# EAGLE design eye (EAGLE 9.6.2)

## Sheet 1 of 2
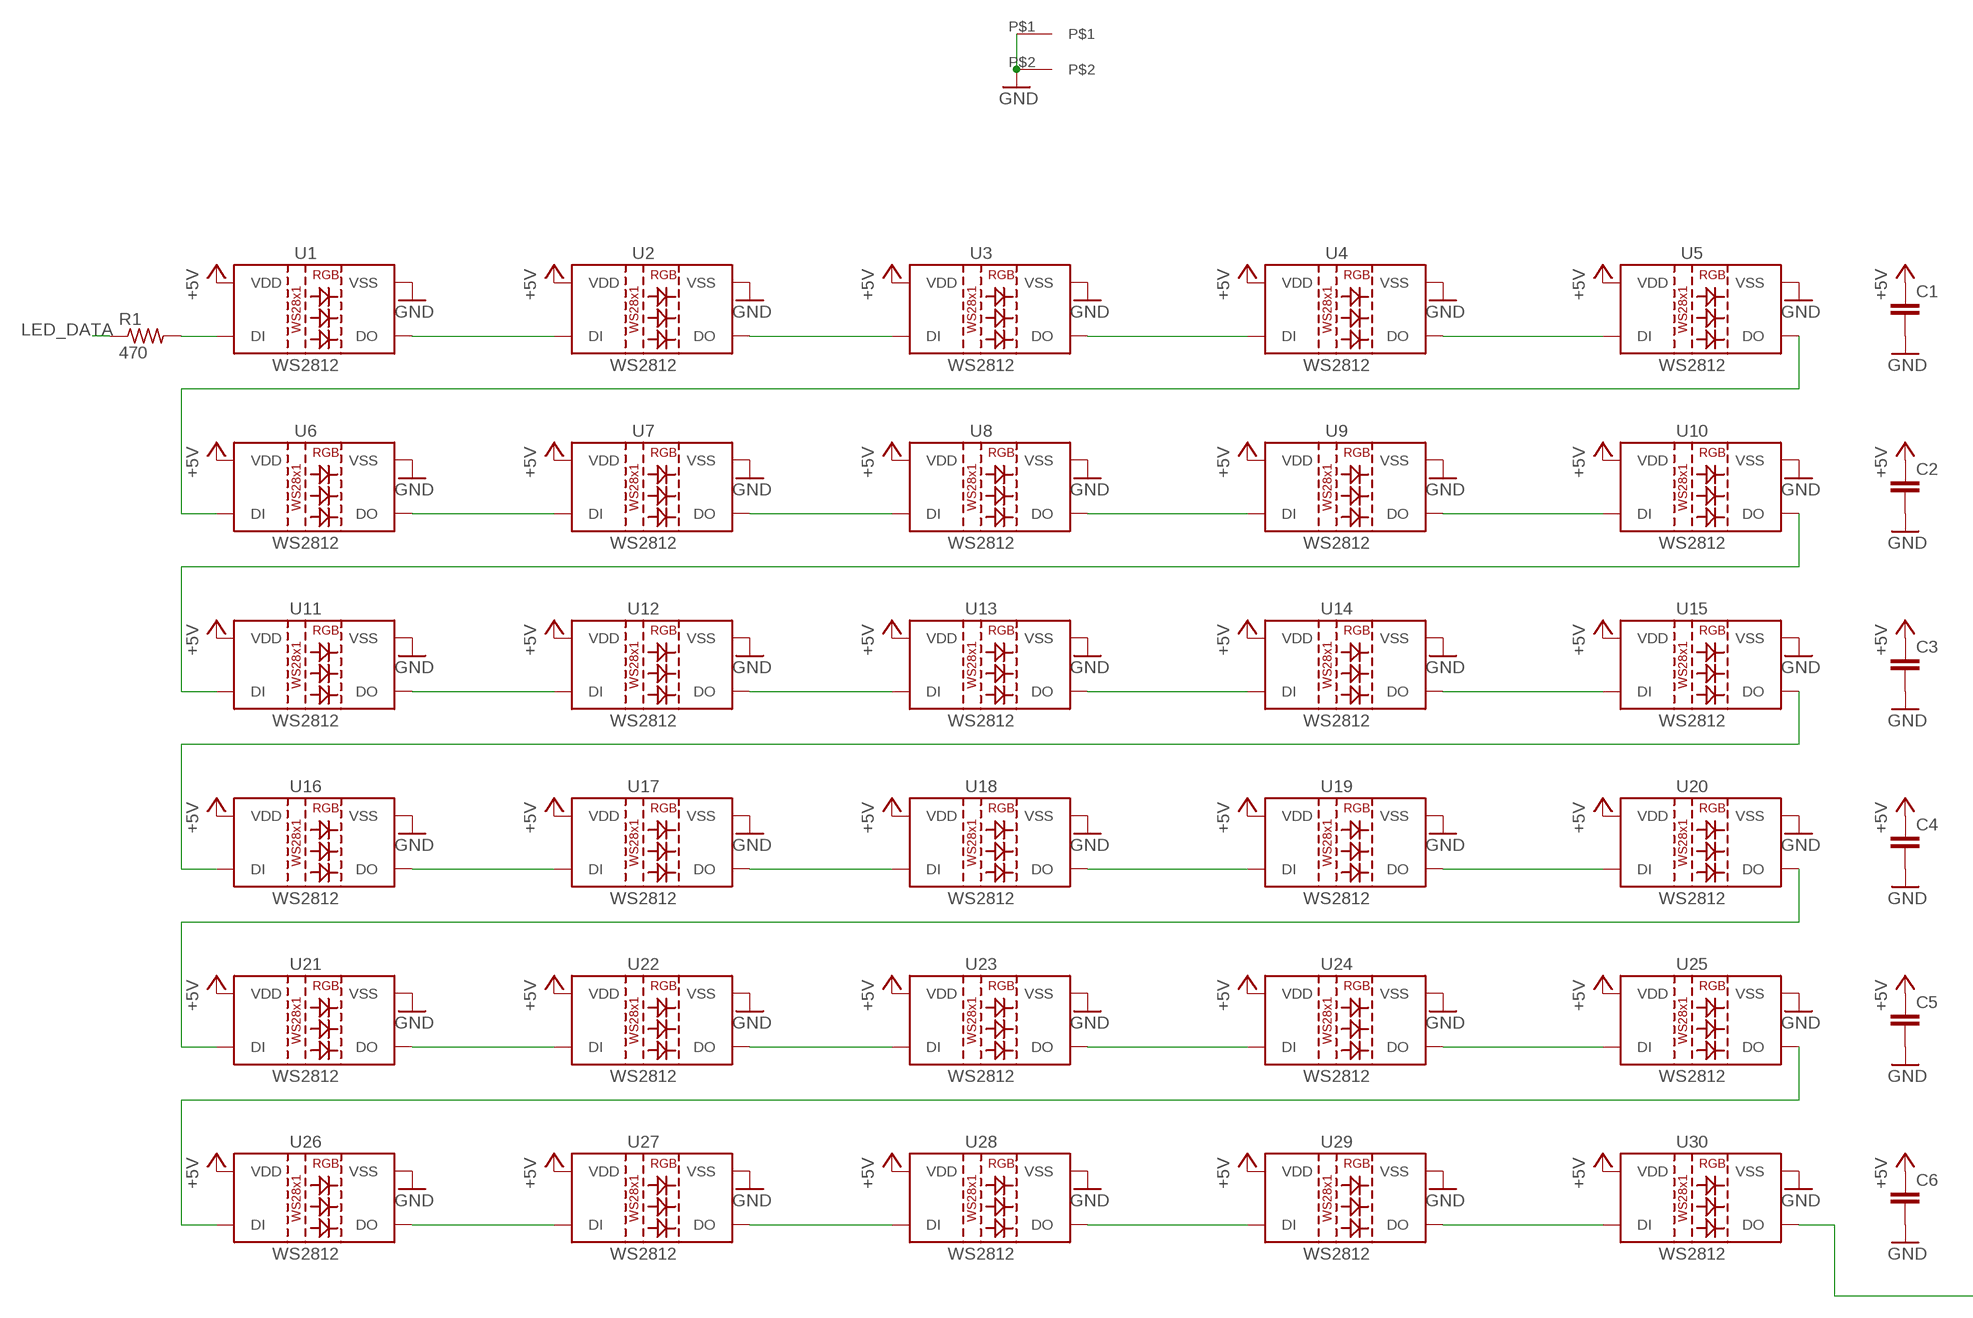
[diagram p0: schematic, sheet 1, part 1 of 2]
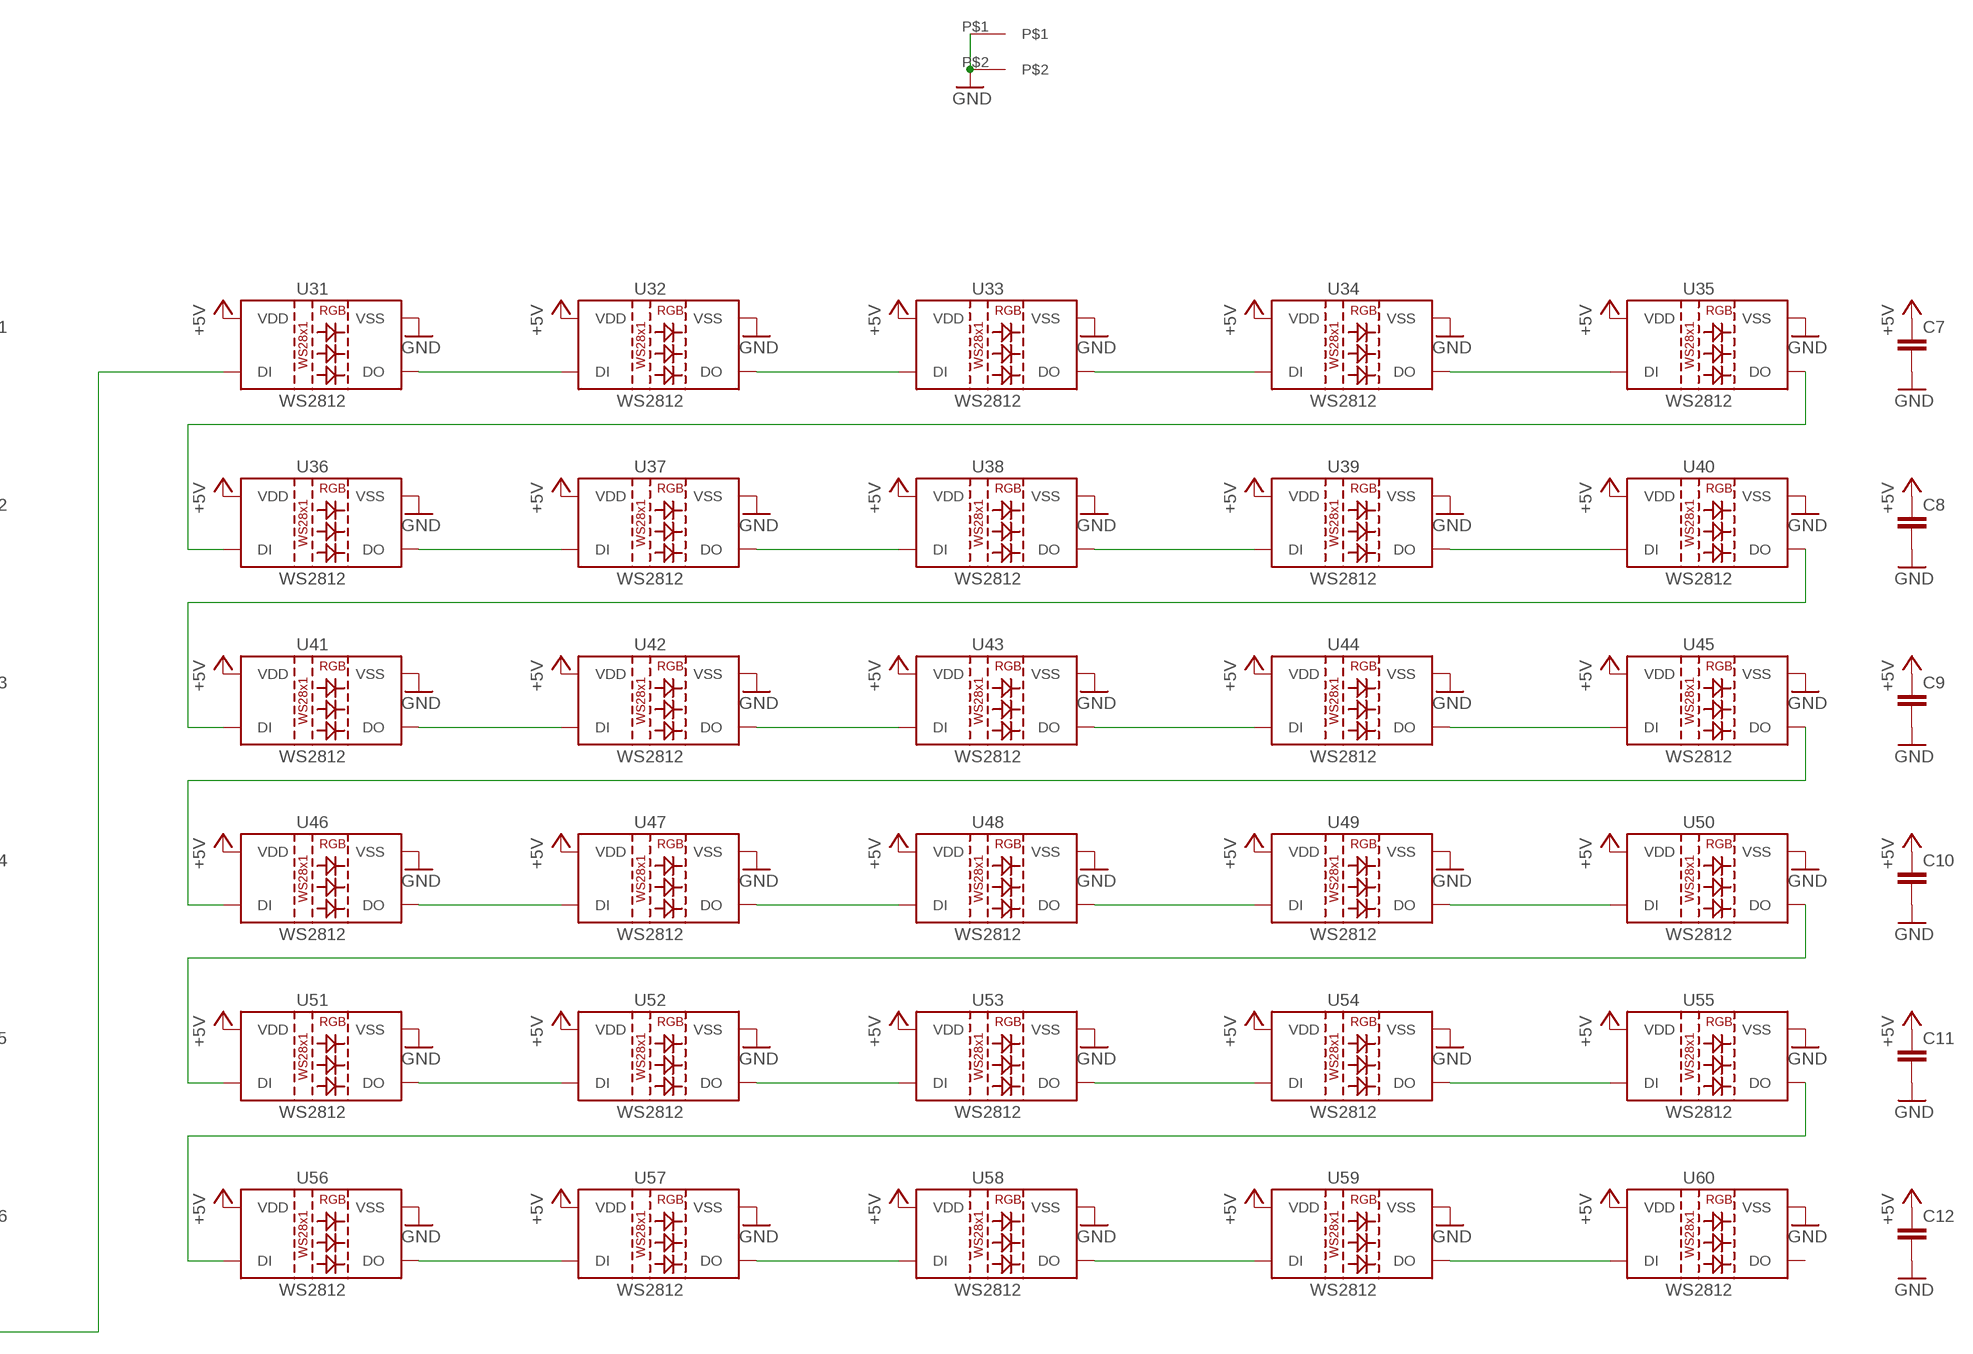
[diagram p1: schematic, sheet 1, part 2 of 2]

### Parts
C1  C-EUC0603  [C0603]
C2  C-EUC0603  [C0603]
C3  C-EUC0603  [C0603]
C4  C-EUC0603  [C0603]
C5  C-EUC0603  [C0603]
C6  C-EUC0603  [C0603]
C7  C-EUC0603  [C0603]
C8  C-EUC0603  [C0603]
C9  C-EUC0603  [C0603]
C10  C-EUC0603  [C0603]
C11  C-EUC0603  [C0603]
C12  C-EUC0603  [C0603]
R1  470  R-US_R0603  [R0603]
U1  WS2812  WS2812"  [LED-TRICOLOR-5050-IC]
U2  WS2812  WS2812"  [LED-TRICOLOR-5050-IC]
U3  WS2812  WS2812"  [LED-TRICOLOR-5050-IC]
U4  WS2812  WS2812"  [LED-TRICOLOR-5050-IC]
U5  WS2812  WS2812"  [LED-TRICOLOR-5050-IC]
U6  WS2812  WS2812"  [LED-TRICOLOR-5050-IC]
U7  WS2812  WS2812"  [LED-TRICOLOR-5050-IC]
U8  WS2812  WS2812"  [LED-TRICOLOR-5050-IC]
U9  WS2812  WS2812"  [LED-TRICOLOR-5050-IC]
U10  WS2812  WS2812"  [LED-TRICOLOR-5050-IC]
U11  WS2812  WS2812"  [LED-TRICOLOR-5050-IC]
U12  WS2812  WS2812"  [LED-TRICOLOR-5050-IC]
U13  WS2812  WS2812"  [LED-TRICOLOR-5050-IC]
U14  WS2812  WS2812"  [LED-TRICOLOR-5050-IC]
U15  WS2812  WS2812"  [LED-TRICOLOR-5050-IC]
U16  WS2812  WS2812"  [LED-TRICOLOR-5050-IC]
U17  WS2812  WS2812"  [LED-TRICOLOR-5050-IC]
U18  WS2812  WS2812"  [LED-TRICOLOR-5050-IC]
U19  WS2812  WS2812"  [LED-TRICOLOR-5050-IC]
U20  WS2812  WS2812"  [LED-TRICOLOR-5050-IC]
U21  WS2812  WS2812"  [LED-TRICOLOR-5050-IC]
U22  WS2812  WS2812"  [LED-TRICOLOR-5050-IC]
U23  WS2812  WS2812"  [LED-TRICOLOR-5050-IC]
U24  WS2812  WS2812"  [LED-TRICOLOR-5050-IC]
U25  WS2812  WS2812"  [LED-TRICOLOR-5050-IC]
U26  WS2812  WS2812"  [LED-TRICOLOR-5050-IC]
U27  WS2812  WS2812"  [LED-TRICOLOR-5050-IC]
U28  WS2812  WS2812"  [LED-TRICOLOR-5050-IC]
U29  WS2812  WS2812"  [LED-TRICOLOR-5050-IC]
U30  WS2812  WS2812"  [LED-TRICOLOR-5050-IC]
U31  WS2812  WS2812"  [LED-TRICOLOR-5050-IC]
U32  WS2812  WS2812"  [LED-TRICOLOR-5050-IC]
U33  WS2812  WS2812"  [LED-TRICOLOR-5050-IC]
U34  WS2812  WS2812"  [LED-TRICOLOR-5050-IC]
U35  WS2812  WS2812"  [LED-TRICOLOR-5050-IC]
U36  WS2812  WS2812"  [LED-TRICOLOR-5050-IC]
U37  WS2812  WS2812"  [LED-TRICOLOR-5050-IC]
U38  WS2812  WS2812"  [LED-TRICOLOR-5050-IC]
U39  WS2812  WS2812"  [LED-TRICOLOR-5050-IC]
U40  WS2812  WS2812"  [LED-TRICOLOR-5050-IC]
U41  WS2812  WS2812"  [LED-TRICOLOR-5050-IC]
U42  WS2812  WS2812"  [LED-TRICOLOR-5050-IC]
U43  WS2812  WS2812"  [LED-TRICOLOR-5050-IC]
U44  WS2812  WS2812"  [LED-TRICOLOR-5050-IC]
U45  WS2812  WS2812"  [LED-TRICOLOR-5050-IC]
U46  WS2812  WS2812"  [LED-TRICOLOR-5050-IC]
U47  WS2812  WS2812"  [LED-TRICOLOR-5050-IC]
U48  WS2812  WS2812"  [LED-TRICOLOR-5050-IC]
U49  WS2812  WS2812"  [LED-TRICOLOR-5050-IC]
U50  WS2812  WS2812"  [LED-TRICOLOR-5050-IC]
U51  WS2812  WS2812"  [LED-TRICOLOR-5050-IC]
U52  WS2812  WS2812"  [LED-TRICOLOR-5050-IC]
U53  WS2812  WS2812"  [LED-TRICOLOR-5050-IC]
U54  WS2812  WS2812"  [LED-TRICOLOR-5050-IC]
U55  WS2812  WS2812"  [LED-TRICOLOR-5050-IC]
U56  WS2812  WS2812"  [LED-TRICOLOR-5050-IC]
U57  WS2812  WS2812"  [LED-TRICOLOR-5050-IC]
U58  WS2812  WS2812"  [LED-TRICOLOR-5050-IC]
U59  WS2812  WS2812"  [LED-TRICOLOR-5050-IC]
U60  WS2812  WS2812"  [LED-TRICOLOR-5050-IC]
U$4  GLASSES_HINGE  [GLASSES_HINGE]
U$5  GLASSES_HINGE  [GLASSES_HINGE]

### Nets
+5V: C1.1 C2.1 C3.1 C4.1 C5.1 C6.1 C7.1 C8.1 C9.1 C10.1 C11.1 C12.1 U1.3(VDD) U1.5(VDD) U2.3(VDD) U2.5(VDD) U3.3(VDD) U3.5(VDD) U4.3(VDD) U4.5(VDD) U5.3(VDD) U5.5(VDD) U6.3(VDD) U6.5(VDD) U7.3(VDD) U7.5(VDD) U8.3(VDD) U8.5(VDD) U9.3(VDD) U9.5(VDD) U10.3(VDD) U10.5(VDD) U11.3(VDD) U11.5(VDD) U12.3(VDD) U12.5(VDD) U13.3(VDD) U13.5(VDD) U14.3(VDD) U14.5(VDD) U15.3(VDD) U15.5(VDD) U16.3(VDD) U16.5(VDD) U17.3(VDD) U17.5(VDD) U18.3(VDD) U18.5(VDD) U19.3(VDD) U19.5(VDD) U20.3(VDD) U20.5(VDD) U21.3(VDD) U21.5(VDD) U22.3(VDD) U22.5(VDD) U23.3(VDD) U23.5(VDD) U24.3(VDD) U24.5(VDD) U25.3(VDD) U25.5(VDD) U26.3(VDD) U26.5(VDD) U27.3(VDD) U27.5(VDD) U28.3(VDD) U28.5(VDD) U29.3(VDD) U29.5(VDD) U30.3(VDD) U30.5(VDD) U31.3(VDD) U31.5(VDD) U32.3(VDD) U32.5(VDD) U33.3(VDD) U33.5(VDD) U34.3(VDD) U34.5(VDD) U35.3(VDD) U35.5(VDD) U36.3(VDD) U36.5(VDD) U37.3(VDD) U37.5(VDD) U38.3(VDD) U38.5(VDD) U39.3(VDD) U39.5(VDD) U40.3(VDD) U40.5(VDD) U41.3(VDD) U41.5(VDD) U42.3(VDD) U42.5(VDD) U43.3(VDD) U43.5(VDD) U44.3(VDD) U44.5(VDD) U45.3(VDD) U45.5(VDD) U46.3(VDD) U46.5(VDD) U47.3(VDD) U47.5(VDD) U48.3(VDD) U48.5(VDD) U49.3(VDD) U49.5(VDD) U50.3(VDD) U50.5(VDD) U51.3(VDD) U51.5(VDD) U52.3(VDD) U52.5(VDD) U53.3(VDD) U53.5(VDD) U54.3(VDD) U54.5(VDD) U55.3(VDD) U55.5(VDD) U56.3(VDD) U56.5(VDD) U57.3(VDD) U57.5(VDD) U58.3(VDD) U58.5(VDD) U59.3(VDD) U59.5(VDD) U60.3(VDD) U60.5(VDD) ; also sheet 2
GND: C1.2 C2.2 C3.2 C4.2 C5.2 C6.2 C7.2 C8.2 C9.2 C10.2 C11.2 C12.2 U1.6(VSS) U2.6(VSS) U3.6(VSS) U4.6(VSS) U5.6(VSS) U6.6(VSS) U7.6(VSS) U8.6(VSS) U9.6(VSS) U10.6(VSS) U11.6(VSS) U12.6(VSS) U13.6(VSS) U14.6(VSS) U15.6(VSS) U16.6(VSS) U17.6(VSS) U18.6(VSS) U19.6(VSS) U20.6(VSS) U21.6(VSS) U22.6(VSS) U23.6(VSS) U24.6(VSS) U25.6(VSS) U26.6(VSS) U27.6(VSS) U28.6(VSS) U29.6(VSS) U30.6(VSS) U31.6(VSS) U32.6(VSS) U33.6(VSS) U34.6(VSS) U35.6(VSS) U36.6(VSS) U37.6(VSS) U38.6(VSS) U39.6(VSS) U40.6(VSS) U41.6(VSS) U42.6(VSS) U43.6(VSS) U44.6(VSS) U45.6(VSS) U46.6(VSS) U47.6(VSS) U48.6(VSS) U49.6(VSS) U50.6(VSS) U51.6(VSS) U52.6(VSS) U53.6(VSS) U54.6(VSS) U55.6(VSS) U56.6(VSS) U57.6(VSS) U58.6(VSS) U59.6(VSS) U60.6(VSS) U$4.P$1 U$4.P$2 U$5.P$1 U$5.P$2 ; also sheet 2
LED_DATA: R1.1 ; also sheet 2
N$1: U1.1(DO) U2.2(DI)
N$2: U2.1(DO) U3.2(DI)
N$3: U3.1(DO) U4.2(DI)
N$4: U4.1(DO) U5.2(DI)
N$5: U5.1(DO) U6.2(DI)
N$6: U6.1(DO) U7.2(DI)
N$7: U7.1(DO) U8.2(DI)
N$8: U8.1(DO) U9.2(DI)
N$9: U9.1(DO) U10.2(DI)
N$10: U10.1(DO) U11.2(DI)
N$11: U11.1(DO) U12.2(DI)
N$12: U12.1(DO) U13.2(DI)
N$13: U13.1(DO) U14.2(DI)
N$14: U14.1(DO) U15.2(DI)
N$15: U15.1(DO) U16.2(DI)
N$16: U16.1(DO) U17.2(DI)
N$17: U17.1(DO) U18.2(DI)
N$18: U18.1(DO) U19.2(DI)
N$19: U19.1(DO) U20.2(DI)
N$20: U20.1(DO) U21.2(DI)
N$21: U21.1(DO) U22.2(DI)
N$22: U22.1(DO) U23.2(DI)
N$23: U23.1(DO) U24.2(DI)
N$24: U24.1(DO) U25.2(DI)
N$25: U25.1(DO) U26.2(DI)
N$26: U26.1(DO) U27.2(DI)
N$27: U27.1(DO) U28.2(DI)
N$28: U28.1(DO) U29.2(DI)
N$29: U29.1(DO) U30.2(DI)
N$31: U31.1(DO) U32.2(DI)
N$32: U32.1(DO) U33.2(DI)
N$33: U33.1(DO) U34.2(DI)
N$34: U34.1(DO) U35.2(DI)
N$35: U35.1(DO) U36.2(DI)
N$36: U36.1(DO) U37.2(DI)
N$37: U37.1(DO) U38.2(DI)
N$38: U38.1(DO) U39.2(DI)
N$39: U39.1(DO) U40.2(DI)
N$40: U40.1(DO) U41.2(DI)
N$41: U41.1(DO) U42.2(DI)
N$42: U42.1(DO) U43.2(DI)
N$43: U43.1(DO) U44.2(DI)
N$44: U44.1(DO) U45.2(DI)
N$45: U45.1(DO) U46.2(DI)
N$46: U46.1(DO) U47.2(DI)
N$47: U47.1(DO) U48.2(DI)
N$48: U48.1(DO) U49.2(DI)
N$49: U49.1(DO) U50.2(DI)
N$50: U50.1(DO) U51.2(DI)
N$51: U51.1(DO) U52.2(DI)
N$52: U52.1(DO) U53.2(DI)
N$53: U53.1(DO) U54.2(DI)
N$54: U54.1(DO) U55.2(DI)
N$55: U55.1(DO) U56.2(DI)
N$56: U56.1(DO) U57.2(DI)
N$57: U57.1(DO) U58.2(DI)
N$58: U58.1(DO) U59.2(DI)
N$59: U59.1(DO) U60.2(DI)
N$60: U30.1(DO) U31.2(DI)
N$61: R1.2 U1.2(DI)
Unconnected: U60.1(DO)

## Sheet 2 of 2
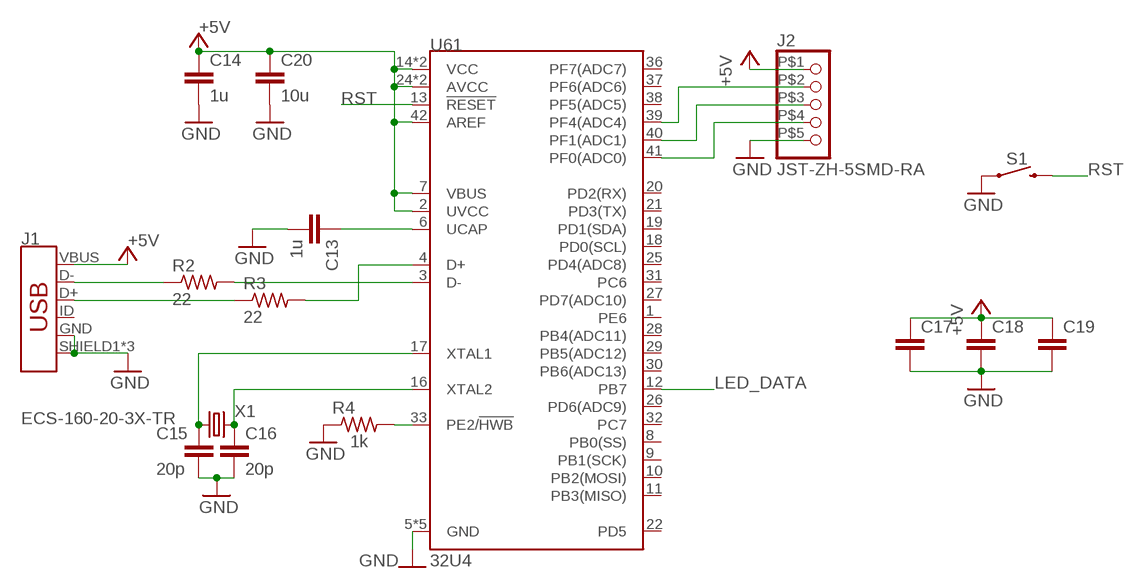
[diagram p2: schematic, sheet 2]

### Parts
C13  1u  C-EUC0603  [C0603]
C14  1u  C-EUC0603  [C0603]
C15  20p  C-EUC0603  [C0603]
C16  20p  C-EUC0603  [C0603]
C17  C-EUC0603  [C0603]
C18  C-EUC0603  [C0603]
C19  C-EUC0603  [C0603]
C20  10u  C-EUC0603  [C0603]
J1  USB_MICRO-B_FEMALE-SMT  [USB-B-MICRO-SMD]
J2  JST-ZH-5SMD-RA  [JST-ZH-5-SMD-RA]
R2  22  R-US_R0603  [R0603]
R3  22  R-US_R0603  [R0603]
R4  1k  R-US_R0603  [R0603]
S1  MOMENTARY-SWITCH-SPST-SMD-6.0X3.5MM  [TACTILE_SWITCH_SMD_6.0X3.5MM]
U61  32U4  ATMEGA32U4QFN  [QFN-44]
X1  ECS-160-20-3X-TR  CRYSTALSMD-5X3.2-2PAD  [CRYSTAL-SMD-5X3.2-2PAD]

### Nets
+5V: C14.1 C17.1 C18.1 C19.1 C20.1 J1.VBUS J2.P$1 U61.2(UVCC) U61.7(VBUS) U61.14(VCC) U61.24(AVCC) U61.34(VCC) U61.42(AREF) U61.44(AVCC) ; also sheet 1
GND: C13.2 C14.2 C15.2 C16.2 C17.2 C18.2 C19.2 C20.2 J1.GND J1.SHIELD1(SHIELD) J1.SHIELD2(SHIELD) J1.SHIELD3(SHIELD) J2.P$5 R4.1 S1.1 U61.5(GND) U61.15(GND) U61.23(GND) U61.35(GND) U61.43(GND) ; also sheet 1
LED_DATA: U61.12(PB7) ; also sheet 1
N$30: J2.P$4 U61.41(PF0(ADC0))
N$62: C13.1 U61.6(UCAP)
N$63: J2.P$3 U61.40(PF1(ADC1))
N$64: J2.P$2 U61.39(PF4(ADC4))
N$67: C16.1 U61.16(XTAL2) X1.P$2
N$68: C15.1 U61.17(XTAL1) X1.P$1
N$77: R4.2 U61.33(PE2/!HWB)
RST: S1.2 U61.13(!RESET)
USB1_N [diff_pair]: J1.D- R2.1
USB1_P [diff_pair]: J1.D+ R3.1
USB_N [diff_pair]: R2.2 U61.3(D-)
USB_P [diff_pair]: R3.2 U61.4(D+)
Unconnected: J1.ID U61.1(PE6) U61.8(PB0(SS)) U61.9(PB1(SCK)) U61.10(PB2(MOSI)) U61.11(PB3(MISO)) U61.18(PD0(SCL)) U61.19(PD1(SDA)) U61.20(PD2(RX)) U61.21(PD3(TX)) U61.22(PD5) U61.25(PD4(ADC8)) U61.26(PD6(ADC9)) U61.27(PD7(ADC10)) U61.28(PB4(ADC11)) U61.29(PB5(ADC12)) U61.30(PB6(ADC13)) U61.31(PC6) U61.32(PC7) U61.36(PF7(ADC7)) U61.37(PF6(ADC6)) U61.38(PF5(ADC5))

## Library data of the parts
C1-C20 = rcl:C-EU: CAPACITOR, European symbol; SPICEPREFIX: C
J1 = SparkFun-Connectors:USB_MICRO-B: USB Type Micro-B Connector Male/female and PTH/SMT variants SparkFun Products: SparkFun microB USB Breakout <https://www.sparkfun.com/products/12035> SparkFun USB microB Plug Breakout <https://www.sparkfun.com/products/10031> SparkFun ESP8266 Thing <https://www.sparkfun.com/products/13231>; PROD_ID: CONN-11752
J2 = josh:JST-ZH-5
R1-R4 = rcl:R-US_: RESISTOR, American symbol; SPICEPREFIX: R
S1 = SparkFun-Switches:MOMENTARY-SWITCH-SPST: Momentary Switch (Pushbutton) - SPST Normally-open (NO) SPST momentary switches (buttons, pushbuttons). Variants PTH-12MM - 12mm square, through-hole Momentary Pushbutton Switch - 12mm Square <https://www.sparkfun.com/products/9190> (COM-09190) PTH-6.0MM, PTH-6.0MM-KIT - 6.0mm square, through-hole Mini Pushbutton Switch <https://www.sparkfun.com/products/97> (COM-00097) KIT package intended for soldering kit's - only one side of pads' copper is exposed. PTH-RIGHT-ANGLE-KIT - Right-angle, through-hole Right Angle Tactile Button <https://www.sparkfun.com/products/10791> - Used on SparkFun BigTime Watch Kit <https://www.sparkfun.com/products/11734> SMD-12MM - 12mm square, surface-mount Tactile Button - SMD (12mm) <https://www.sparkfun.com/products/12993> (COM-12993) Used on SparkFun PicoBoard <https://www.sparkfun.com/products/11888> SMD-4.5MM - 4.5mm Square Trackball Switch Used on SparkFun Blackberry Trackballer Breakout <https://www.sparkfun.com/products/13169> SMD-4.6MMX2.8MM - 4.60mm x 2.80mm, surface mount Used on SparkFun SAMD21 Mini Breakout <https://www.sparkfun.com/products/13664> SMD-5.2MM, SMD-5.2-REDUNDANT - 5.2mm square, surface-mount Mini Pushbutton Switch - SMD <https://www.sparkfun.com/products/8720> (COM-08720) Used on Arduino Pro Mini <https://www.sparkfun.com/products/11114> REDUNDANT package connects both switch circuits together SMD-6.0X3.5MM - 6.0 x 3.5mm, surface mount Momentary Reset Switch SMD <https://www.sparkfun.com/products/8229> (COM-08229) SMD-6.2MM-TALL - 6.2mm square, surface mount Tactile Button - SMD (6mm) <https://www.sparkfun.com/products/12992> Used on SparkFun Digital Sandbox <https://www.sparkfun.com/products/12651> SMD-RIGHT-ANGLE - Right-angle, surface mount Used on SparkFun Block for Intel® Edison - Arduino <https://www.sparkfun.com/products/13036>; PROD_ID: SWCH-14278; SF_SKU: COM-08229
U1-U60 = SparkFun-LED:WS2812: WS2812 RGB LED w/ WS2811 driver 5x5mm SMD LED with built-in controller IC. Color: Red/Green/Blue mC Rating: RGB: 550, 1100, 200 mcd Current:RGB: 20, 20, 20 mA Forward Voltage: RGB: 1.8, 3.0, 3.2 V Packages:LED-TRICOLOR-5050-IC SparkFun Products: LED-SMD RGB (WS2812) <https://www.sparkfun.com/products/11821>; PROD_ID: DIO-11598
U61 = SparkFun-IC-Microcontroller:ATMEGA32U4: Atmel MCU, 32KByte Atmel 44-pin 8-bit Microcontroller with 32KBytes of ISP Flash and USB Controller Datasheet <http://cdn.sparkfun.com/datasheets/Dev/Arduino/Boards/ATMega32U4.pdf> SparkFun Products LilyPad Arduino USB - ATmega32U4 Board <https://www.sparkfun.com/products/12049> (DEV-12049) Pro Micro - 5V/16MHz <https://www.sparkfun.com/products/12640> (DEV-12640) Pro Micro - 3.3V/8MHz <https://www.sparkfun.com/products/12587> (DEV-12587) Fio v3 - ATmega32U4 <https://www.sparkfun.com/products/11520> (DEV-11520) Qduino Mini <https://www.sparkfun.com/products/13614> (DEV-13614) Makey Makey - Standard Kit <https://www.sparkfun.com/products/11511> (WIG-11511) Makey Makey Deluxe Kit <https://www.sparkfun.com/products/11519> (WIG-11519); PROD_ID: IC-10828
U$4 U$5 = josh:GLASSES_HINGE
X1 = SparkFun-Clocks:CRYSTAL: Crystals (Generic) These are passive quartz crystals, which can be used as a clock source for a microcontroller. Crystal's are two-terminal devices. They require external "load" capacitors to generate an oscillating signal.

## Net classes
2 mult: clearance 0.025 mm

## Board
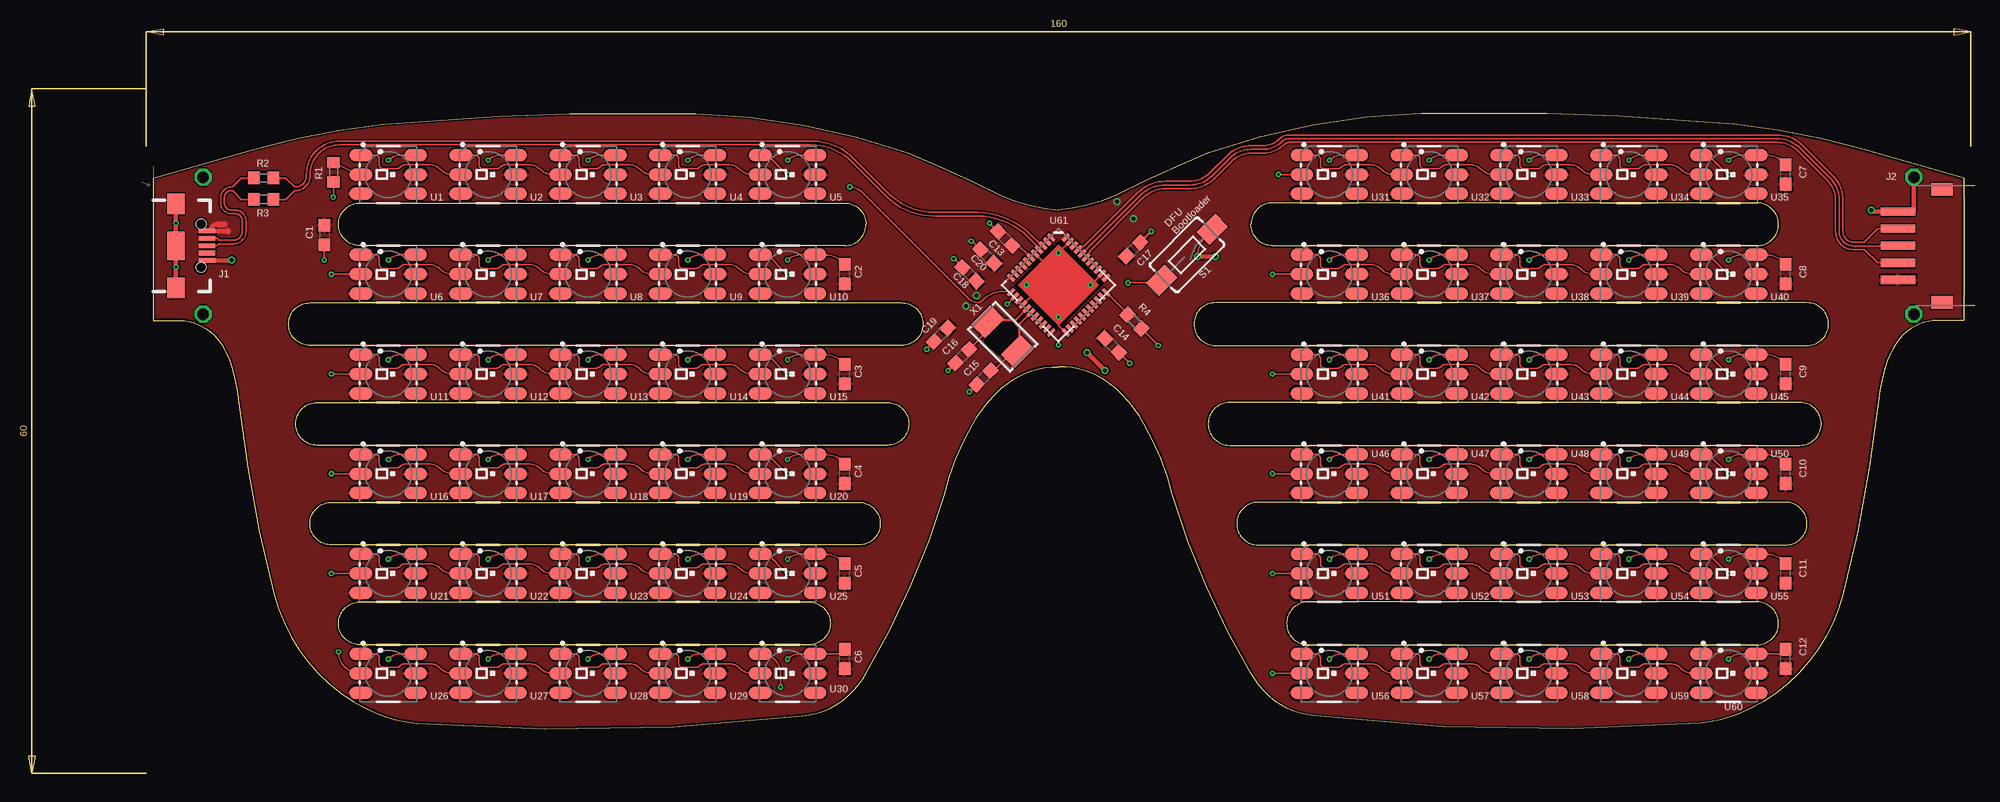
[diagram p3: board, top side]
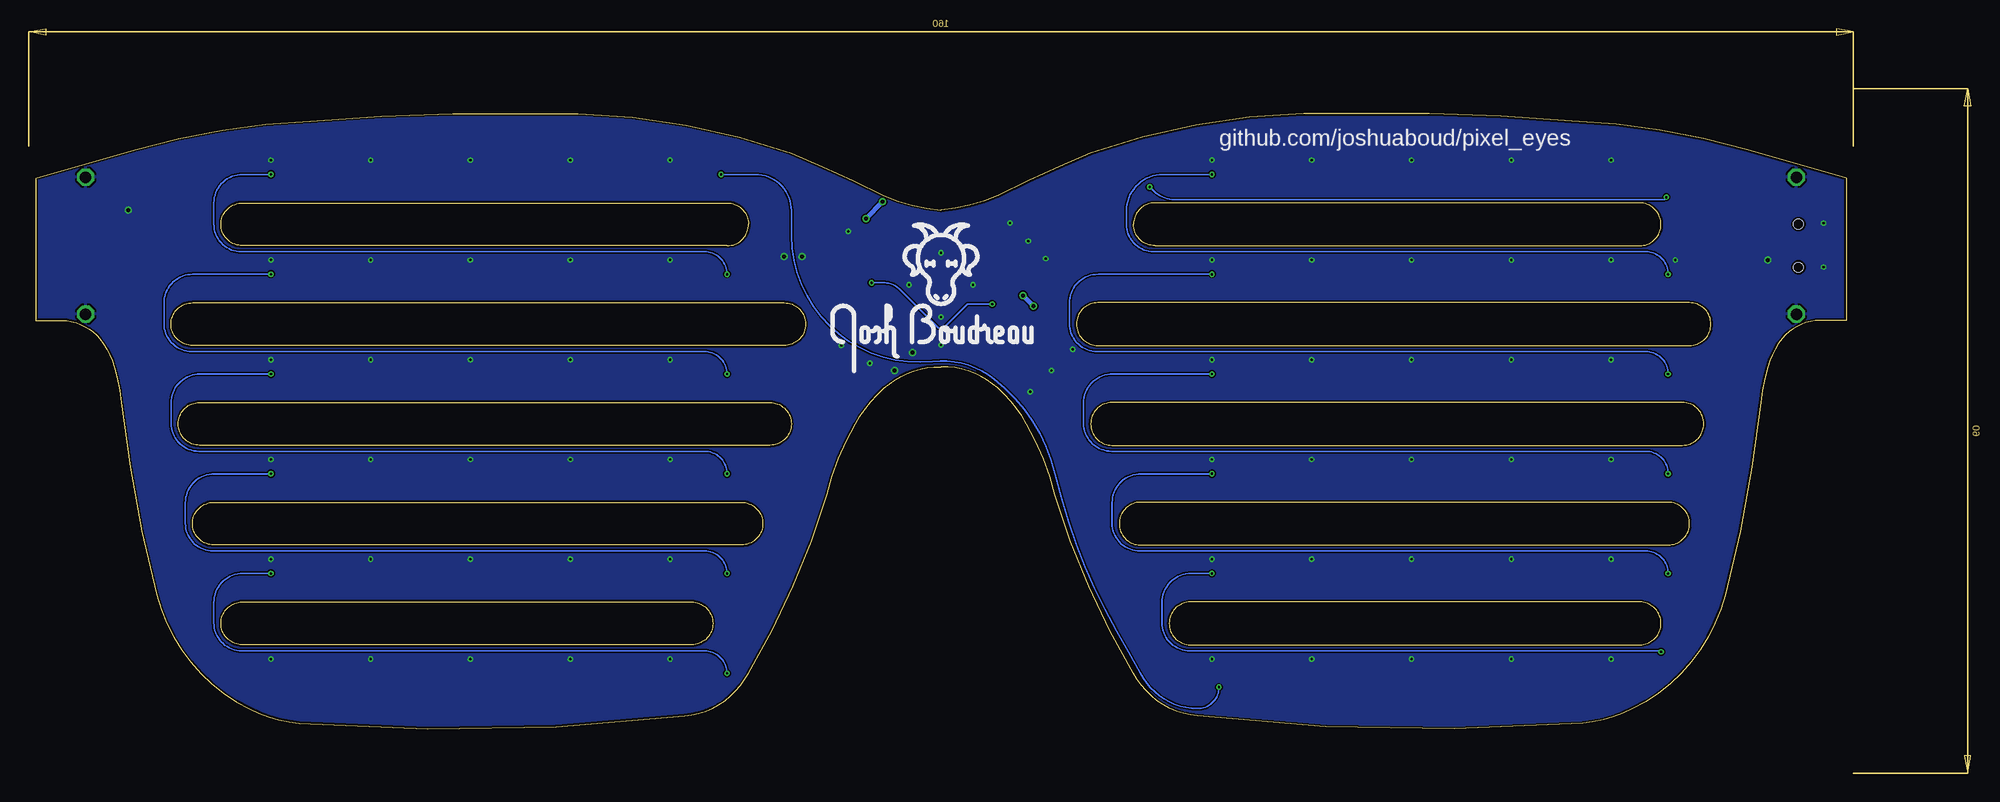
[diagram p4: board, bottom side, seen from below]

Size 158.75 x 53.97 mm. Coordinates in mm from the lower left corner, seen from the top.
Outline: 0,48.32 8.75,50.82 arc-13 24.06,53.32 arc-6 42.81,53.94 arc-22 66.25,50.51 arc-4 74.38,46.76 arc17 79.38,45.51 arc17 84.38,46.76 arc-4 92.5,50.51 arc-22 115.94,53.94 arc-6 134.69,53.32 arc-13 150,50.82 158.75,48.32 158.75,35.82 156.88,35.82 arc53 153.12,34.26 arc21 151.88,31.76 arc10 151.25,28.63 arc-8 148.12,11.76 arc-49 140,1.76 arc-21 135.62,0.51 arc-11 101.88,1.13 arc-56 96.25,4.88 arc-14 89.38,20.51 arc16 86.88,26.76 arc18 84.38,29.88 arc43 79.38,31.76 arc43 74.38,29.88 arc18 71.88,26.76 arc16 69.38,20.51 arc-14 62.5,4.88 arc-56 56.88,1.13 arc-11 23.12,0.51 arc-21 18.75,1.76 arc-49 10.62,11.76 arc-8 7.5,28.63 arc10 6.88,31.76 arc21 5.62,34.26 arc53 1.88,35.82 0,35.82 0,48.32
Outline: 18.12,46.13 60.62,46.13 arc-90 62.5,44.26 arc-90 60.62,42.38 18.12,42.38 arc-90 16.25,44.26 arc-90 18.12,46.13
Outline: 11.88,35.51 arc-90 13.75,37.38 65.62,37.38 arc-90 67.5,35.51 arc-90 65.62,33.63 13.75,33.63 arc-90 11.88,35.51
Outline: 12.5,26.76 arc-90 14.38,28.63 64.38,28.63 arc-90 66.25,26.76 arc-90 64.38,24.88 14.38,24.88 arc-90 12.5,26.76
Outline: 13.75,18.01 arc-90 15.62,19.88 61.88,19.88 arc-90 63.75,18.01 arc-90 61.88,16.13 15.62,16.13 arc-90 13.75,18.01
Outline: 16.25,9.26 arc-90 18.12,11.13 57.5,11.13 arc-90 59.38,9.26 arc-90 57.5,7.38 18.12,7.38 arc-90 16.25,9.26
Outline: 140.62,46.13 98.12,46.13 arc90 96.25,44.26 arc90 98.12,42.38 140.62,42.38 arc90 142.5,44.26 arc90 140.62,46.13
Outline: 146.88,35.51 arc90 145,37.38 93.12,37.38 arc90 91.25,35.51 arc90 93.12,33.63 145,33.63 arc90 146.88,35.51
Outline: 146.25,26.76 arc90 144.38,28.63 94.38,28.63 arc90 92.5,26.76 arc90 94.38,24.88 144.38,24.88 arc90 146.25,26.76
Outline: 145,18.01 arc90 143.12,19.88 96.88,19.88 arc90 95,18.01 arc90 96.88,16.13 143.12,16.13 arc90 145,18.01
Outline: 142.5,9.26 arc90 140.62,11.13 101.25,11.13 arc90 99.38,9.26 arc90 101.25,7.38 140.62,7.38 arc90 142.5,9.26
Copper layers (1*16): Top 0.035mm / dielectric 1.5mm / Bottom 0.035mm
Design rules "jlcpcb *": minimum track width 5mil, minimum drill 0.2mm, track to track 5mil, track to pad 0.2mm, pad to pad 0.2mm, via to via 0.2mm, smd to smd 0.2mm, copper to edge 0.2mm, drill to drill 0.2mm, minimum pad ring 0.13mm, minimum via ring 0.13mm, stop-mask expansion 4mil, vias tented up to drill 0mil, thermal gap 0.2mm
tRestrict: area 72.8,32.7 to 75.7,35.6; 17 lines

### Footprints (pad centres in the part's own frame; a part is rotated, then mirrored left to right if it is on the bottom)
C0603 = smd 1.1 x 1: 1 -0.85,0; 2 0.85,0
USB-B-MICRO-SMD = smd 1.45 x 0.4: D+ 2.725,0; D- 2.725,0.65; GND 2.725,-1.3; ID 2.725,-0.65; VBUS 2.725,1.3 | smd 1.5 x 1.8: SHIELD1 0,3.685; SHIELD2 0,-3.685 | smd 1.5 x 2.5: SHIELD3 0,0 | hole 0.85: 2.2,1.9; 2.2,-1.9
JST-ZH-5-SMD-RA = smd 0.72 x 3: P$1 3,-1.5; P$2 1.5,-1.5; P$3 0,-1.5; P$4 -1.5,-1.5; P$5 -3,-1.5 | smd 1.1 x 1.9: P$6 4.95,2.35; P$7 -4.95,2.35
R0603 = smd 1 x 1.1: 1 -0.85,0; 2 0.85,0
TACTILE_SWITCH_SMD_6.0X3.5MM = smd 2.3 x 1.6: 1 -3.15,0; 2 3.15,0
LED-TRICOLOR-5050-IC = smd 2 x 1.1: 1 -2.4,1.7; 2 -2.4,0; 3 -2.4,-1.7; 4 2.4,-1.7; 5 2.4,0; 6 2.4,1.7
QFN-44 = smd 0.8 x 0.3: 1 -3.4,2.5; 2 -3.4,2; 3 -3.4,1.5; 4 -3.4,1; 5 -3.4,0.5; 6 -3.4,0; 7 -3.4,-0.5; 8 -3.4,-1; 9 -3.4,-1.5; 10 -3.4,-2; 11 -3.4,-2.5; 23 3.4,-2.5; 24 3.4,-2; 25 3.4,-1.5; 26 3.4,-1; 27 3.4,-0.5; 28 3.4,0; 29 3.4,0.5; 30 3.4,1; 31 3.4,1.5; 32 3.4,2; 33 3.4,2.5 | smd 0.3 x 0.8: 12 -2.5,-3.4; 13 -2,-3.4; 14 -1.5,-3.4; 15 -1,-3.4; 16 -0.5,-3.4; 17 0,-3.4; 18 0.5,-3.4; 19 1,-3.4; 20 1.5,-3.4; 21 2,-3.4; 22 2.5,-3.4; 34 2.5,3.4; 35 2,3.4; 36 1.5,3.4; 37 1,3.4; 38 0.5,3.4; 39 0,3.4; 40 -0.5,3.4; 41 -1,3.4; 42 -1.5,3.4; 43 -2,3.4; 44 -2.5,3.4
GLASSES_HINGE = drill 1 octagon: P$1 0,6; P$2 0,-6
CRYSTAL-SMD-5X3.2-2PAD = smd 1.7 x 2.4: P$1 1.85,0; P$2 -1.85,0

### Placement (x,y rotation side)
C1  15,43.32 270 top
C2  60.62,39.88 90 top
C3  60.62,31.13 90 top
C4  60.62,22.38 90 top
C5  60.62,13.63 90 top
C6  60.62,6.13 90 top
C7  143.12,48.63 90 top
C8  143.12,39.88 90 top
C9  143.12,31.13 90 top
C10  143.12,22.38 90 top
C11  143.12,13.63 90 top
C12  143.12,6.13 90 top
C13  74.69,43.01 135 top
C14  84.06,33.63 315 top
C15  72.81,30.82 225 top
C16  70.94,32.69 225 top
C17  85.94,42.07 45 top
C18  71.56,39.88 135 top
C19  69.06,34.57 225 top
C20  73.12,41.44 135 top
J1  2,42.38 0 top
J2  154.47,42.38 270 top
R1  15.81,48.82 90 top
R2  9.69,48.32 0 top
R3  9.69,46.44 0 top
R4  86.03,35.73 135 top
S1  90.64,41.58 225 top
U1  20.62,48.63 0 top
U2  29.38,48.63 0 top
U3  38.12,48.63 0 top
U4  46.88,48.63 0 top
U5  55.62,48.63 0 top
U6  20.62,39.88 0 top
U7  29.38,39.88 0 top
U8  38.12,39.88 0 top
U9  46.88,39.88 0 top
U10  55.62,39.88 0 top
U11  20.62,31.13 0 top
U12  29.38,31.13 0 top
U13  38.12,31.13 0 top
U14  46.88,31.13 0 top
U15  55.62,31.13 0 top
U16  20.62,22.38 0 top
U17  29.38,22.38 0 top
U18  38.12,22.38 0 top
U19  46.88,22.38 0 top
U20  55.62,22.38 0 top
U21  20.62,13.63 0 top
U22  29.38,13.63 0 top
U23  38.12,13.63 0 top
U24  46.88,13.63 0 top
U25  55.62,13.63 0 top
U26  20.62,4.88 0 top
U27  29.38,4.88 0 top
U28  38.12,4.88 0 top
U29  46.88,4.88 0 top
U30  55.62,4.88 0 top
U31  103.12,48.63 0 top
U32  111.88,48.63 0 top
U33  120.62,48.63 0 top
U34  129.38,48.63 0 top
U35  138.12,48.63 0 top
U36  103.12,39.88 0 top
U37  111.88,39.88 0 top
U38  120.62,39.88 0 top
U39  129.38,39.88 0 top
U40  138.12,39.88 0 top
U41  103.12,31.13 0 top
U42  111.88,31.13 0 top
U43  120.62,31.13 0 top
U44  129.38,31.13 0 top
U45  138.12,31.13 0 top
U46  103.12,22.38 0 top
U47  111.88,22.38 0 top
U48  120.62,22.38 0 top
U49  129.38,22.38 0 top
U50  138.12,22.38 0 top
U51  103.12,13.63 0 top
U52  111.88,13.63 0 top
U53  120.62,13.63 0 top
U54  129.38,13.63 0 top
U55  138.12,13.63 0 top
U56  103.12,4.88 0 top
U57  111.88,4.88 0 top
U58  120.62,4.88 0 top
U59  129.38,4.88 0 top
U60  138.12,4.88 0 top
U61  79.38,38.93 315 top
U$1  [SIGNATURE]  79.38,34.26 0 bottom
U$2  [LOGO_SILKSCREEN]  79.38,40.82 0 bottom
U$4  4.38,42.38 0 top
U$5  154.38,42.38 0 top
X1  74.47,34.41 315 top

### Tracks (layer width: path | path; a pad name or v marks a point on that pad's centre or on a via)
+5V  (via drill 0.35)
  Top 0.127: J1.VBUS arc-90 4.67,43.63 4.06,43.63
  Top 0.406: 5.62,44.26 arc90 5.05,43.68 J1.VBUS 6.51,43.68
  Top 0.508: 5.62,44.26 6.25,44.26 | 6.51,43.68 arc-90 6.56,43.63
  Bottom 0.406: v85.95,44.77 v84.49,46.23 | v72.2,38.01 v71.26,37.07
  pour Top: -10.62,61.13 164.38,61.13 164.38,-3.87 -10.62,-3.87
GND  (via drill 0.2, 0.35)
  Top 0.127: C13.2 arc45 73.94,43.67 73.32,44.35 v73.33,44.36
  Top 0.152: U1.6 21.71,50.33 arc45 v20.62,49.88 | U2.6 30.46,50.33 arc45 v29.38,49.88 | U3.6 39.21,50.33 arc45 v38.12,49.88 | v46.88,49.88 arc-45 47.96,50.33 U4.6 | v55.62,49.88 arc-45 56.71,50.33 U5.6 | v20.62,41.13 arc-45 21.71,41.58 U6.6 | v29.38,41.13 arc-45 30.46,41.58 U7.6 | v38.12,41.13 arc-45 39.21,41.58 U8.6 | v46.88,41.13 arc-45 47.96,41.58 U9.6 | v55.62,41.13 arc-45 56.71,41.58 U10.6 58.82,41.58 arc-45 60.62,40.84 C2.2 | v20.62,32.38 arc-45 21.71,32.83 U11.6 | v29.38,32.38 arc-45 30.46,32.83 U12.6 | v38.12,32.38 arc-45 39.21,32.83 U13.6 | v46.88,32.38 arc-45 47.96,32.83 U14.6 | v55.62,32.38 arc-45 56.71,32.83 U15.6 58.82,32.83 arc-45 60.62,32.09 C3.2 | v20.62,23.63 arc-45 21.71,24.08 U16.6 | v29.38,23.63 arc-45 30.46,24.08 U17.6 | v38.12,23.63 arc-45 39.21,24.08 U18.6 | v46.88,23.63 arc-45 47.96,24.08 U19.6 | v55.62,23.63 arc-45 56.71,24.08 U20.6 58.82,24.08 arc-45 60.62,23.34 C4.2 | v20.62,14.88 arc-45 21.71,15.33 U21.6 | v29.38,14.88 arc-45 30.46,15.33 U22.6 | v38.12,14.88 arc-45 39.21,15.33 U23.6 | v46.88,14.88 arc-45 47.96,15.33 U24.6 | v55.62,14.88 arc-45 56.71,15.33 U25.6 58.82,15.33 arc-45 60.62,14.59 C5.2 | v20.62,6.13 arc-45 21.71,6.58 U26.6 | v29.38,6.13 arc-45 30.46,6.58 U27.6 | v38.12,6.13 arc-45 39.21,6.58 U28.6 | v46.88,6.13 arc-45 47.96,6.58 U29.6 | v55.62,6.13 arc-45 56.71,6.58 U30.6 60.12,6.58 C6.2 | U31.6 104.21,50.33 arc45 v103.12,49.88 | U32.6 112.96,50.33 arc45 v111.88,49.88 | U33.6 121.71,50.33 arc45 v120.62,49.88 | v129.38,49.88 arc-45 130.46,50.33 U34.6 | v138.12,49.88 arc-45 139.21,50.33 U35.6 141.32,50.33 arc-45 143.12,49.59 C7.2 | v103.12,41.13 arc-45 104.21,41.58 U36.6
  Top 0.152: v111.88,41.13 arc-45 112.96,41.58 U37.6 | v120.62,41.13 arc-45 121.71,41.58 U38.6 | v129.38,41.13 arc-45 130.46,41.58 U39.6 | v138.12,41.13 arc-45 139.21,41.58 U40.6 141.32,41.58 arc-45 143.12,40.84 C8.2 | v103.12,32.38 arc-45 104.21,32.83 U41.6 | v111.88,32.38 arc-45 112.96,32.83 U42.6 | v120.62,32.38 arc-45 121.71,32.83 U43.6 | v129.38,32.38 arc-45 130.46,32.83 U44.6 | v138.12,32.38 arc-45 139.21,32.83 U45.6 141.32,32.83 arc-45 143.12,32.09 C9.2 | v103.12,23.63 arc-45 104.21,24.08 U46.6 | v111.88,23.63 arc-45 112.96,24.08 U47.6 | v120.62,23.63 arc-45 121.71,24.08 U48.6 | v129.38,23.63 arc-45 130.46,24.08 U49.6 | v138.12,23.63 arc-45 139.21,24.08 U50.6 141.32,24.08 arc-45 143.12,23.34 C10.2 | v103.12,14.88 arc-45 104.21,15.33 U51.6 | v111.88,14.88 arc-45 112.96,15.33 U52.6 | v120.62,14.88 arc-45 121.71,15.33 U53.6 | v129.38,14.88 arc-45 130.46,15.33 U54.6 | v138.12,14.88 arc-45 139.21,15.33 U55.6 141.32,15.33 arc-45 143.12,14.59 C11.2 | v103.12,6.13 arc-45 104.21,6.58 U56.6 | v111.88,6.13 arc-45 112.96,6.58 U57.6 | v120.62,6.13 arc-45 121.71,6.58 U58.6 | v129.38,6.13 arc-45 130.46,6.58 U59.6 | v138.12,6.13 arc-45 139.21,6.58 U60.6 142.62,6.58 C12.2 | C1.2 v15,41.13 | C19.2 67.85,33.35 arc45 v67.83,33.3 | v79.37,33.68 79.37,34.11 U61.23 79.38,35.4 v79.38,36.13 | C18.2 v70.2,41.24 | v70.2,41.24 | C14.2 v85.62,32.07 | v85.62,32.07 | R4.1 v88.12,33.63 | v88.12,33.63 | S1.1 92.31,43.24 arc45 v91.56,41.44 | U61.15 77.04,38.01 77.04,38.47 v76.56,38.94 | U61.5 78.12,40.89 78.51,40.89 v79.38,41.76 U61.43 | U61.35 82.22,38.94 v82.19,38.94 | C20.2 71.8,42.77 arc45 v71.74,42.79
  Top 0.254: C16.2 v69.69,31.44 | C15.2 v71.56,29.57 | v87.5,43.63 C17.2
  Top 0.406: J1.GND 6.83,41.08 arc90 v6.88,41.13 | J1.SHIELD1 v2,44.36 J1.SHIELD3 v2,40.51 J1.SHIELD2 | U$5.P$1 154.38,45.38 J2.P$5 150.75,45.38 arc-90 v150.62,45.51 | v81.88,33.01 v83.44,31.44 | v91.56,41.44 v93.12,41.44
  pour Bottom: -10.62,61.13 164.38,61.13 164.38,-3.87 -10.62,-3.87
LED_DATA  (via drill 0.2)
  Top 0.152: v15.77,46.63 arc-45 15.81,46.72 R1.1 | v61.08,47.53 arc-45 62.1,47.11 71.43,37.78 arc45 72.32,37.41 arc45 72.71,37.57 72.88,37.73 arc-45 74.38,38.36 75.14,38.36 U61.12
  Bottom 0.152: v61.08,47.53 60.72,47.18 arc-45 58.92,46.43 15.98,46.43 v15.77,46.63
N$1
  Top 0.152: U2.2 26.26,48.63 arc-45 25.18,49.08 arc45 24.21,49.48 22.16,49.48 arc45 21.68,49.28 arc-45 21.31,49.13 20.18,49.13 arc-90 19.82,49.48 19.82,49.98 arc90 19.48,50.33 U1.1
N$2
  Top 0.152: U3.2 35.01,48.63 arc-45 33.92,49.08 arc45 32.96,49.48 30.91,49.48 arc45 30.43,49.28 arc-45 30.06,49.13 28.93,49.13 arc-90 28.57,49.48 28.57,49.98 arc90 28.23,50.33 U2.1
N$3
  Top 0.152: U4.2 43.76,48.63 arc-45 42.67,49.08 arc45 41.71,49.48 39.66,49.48 arc45 39.17,49.28 arc-45 38.81,49.13 37.67,49.13 arc-90 37.33,49.48 37.33,49.98 arc90 36.98,50.33 U3.1
N$4
  Top 0.152: U5.2 52.51,48.63 arc-45 51.42,49.08 arc45 50.46,49.48 48.41,49.48 arc45 47.92,49.28 arc-45 47.56,49.13 46.42,49.13 arc-90 46.08,49.48 46.08,49.98 arc90 45.73,50.33 U4.1
N$5  (via drill 0.2)
  Top 0.152: U5.1 53.85,50.33 55.5,48.68 arc45 v55.62,48.63 | v15.62,39.88 U6.2
  Bottom 0.152: v55.62,48.63 59.92,48.63 arc-90 63.12,45.43 63.12,44.26 arc-90 60.73,41.86 17.6,41.86 arc90 v15.62,39.88
N$6
  Top 0.152: U7.2 26.26,39.88 arc-45 25.18,40.33 arc45 24.21,40.73 22.16,40.73 arc45 21.68,40.53 arc-45 21.31,40.38 20.18,40.38 arc-90 19.82,40.73 19.82,41.23 arc90 19.48,41.58 U6.1
N$7
  Top 0.152: U8.2 35.01,39.88 arc-45 33.92,40.33 arc45 32.96,40.73 30.91,40.73 arc45 30.43,40.53 arc-45 30.06,40.38 28.93,40.38 arc-90 28.57,40.73 28.57,41.23 arc90 28.23,41.58 U7.1
N$8
  Top 0.152: U9.2 43.76,39.88 arc-45 42.67,40.33 arc45 41.71,40.73 39.66,40.73 arc45 39.17,40.53 arc-45 38.81,40.38 37.67,40.38 arc-90 37.33,40.73 37.33,41.23 arc90 36.98,41.58 U8.1
N$9
  Top 0.152: U10.2 52.51,39.88 arc-45 51.42,40.33 arc45 50.46,40.73 48.41,40.73 arc45 47.92,40.53 arc-45 47.56,40.38 46.42,40.38 arc-90 46.08,40.73 46.08,41.23 arc90 45.73,41.58 U9.1
N$10  (via drill 0.2)
  Top 0.152: U10.1 53.85,41.58 55.5,39.93 arc45 v55.62,39.88 | v15.62,31.13 U11.2
  Bottom 0.152: v55.62,39.88 65.58,39.88 arc-90 68.12,37.34 68.12,35.55 arc-90 65.69,33.11 17.6,33.11 arc90 v15.62,31.13
N$11
  Top 0.152: U12.2 26.26,31.13 arc-45 25.18,31.58 arc45 24.21,31.98 22.16,31.98 arc45 21.68,31.78 arc-45 21.31,31.63 20.18,31.63 arc-90 19.82,31.98 19.82,32.48 arc90 19.48,32.83 U11.1
N$12
  Top 0.152: U13.2 35.01,31.13 arc-45 33.92,31.58 arc45 32.96,31.98 30.91,31.98 arc45 30.43,31.78 arc-45 30.06,31.63 28.93,31.63 arc-90 28.57,31.98 28.57,32.48 arc90 28.23,32.83 U12.1
N$13
  Top 0.152: U14.2 43.76,31.13 arc-45 42.67,31.58 arc45 41.71,31.98 39.66,31.98 arc45 39.17,31.78 arc-45 38.81,31.63 37.67,31.63 arc-90 37.33,31.98 37.33,32.48 arc90 36.98,32.83 U13.1
N$14
  Top 0.152: U15.2 52.51,31.13 arc-45 51.42,31.58 arc45 50.46,31.98 48.41,31.98 arc45 47.92,31.78 arc-45 47.56,31.63 46.42,31.63 arc-90 46.08,31.98 46.08,32.48 arc90 45.73,32.83 U14.1
N$15  (via drill 0.2)
  Top 0.152: U15.1 53.85,32.83 55.5,31.18 arc45 v55.62,31.13 | v15.62,22.38 U16.2
  Bottom 0.152: v55.62,31.13 64.33,31.13 arc-90 66.88,28.59 66.88,26.8 arc-90 64.44,24.36 17.6,24.36 arc90 v15.62,22.38
N$16
  Top 0.152: U17.2 26.26,22.38 arc-45 25.18,22.83 arc45 24.21,23.23 22.16,23.23 arc45 21.68,23.03 arc-45 21.31,22.88 20.18,22.88 arc-90 19.82,23.23 19.82,23.73 arc90 19.48,24.08 U16.1
N$17
  Top 0.152: U18.2 35.01,22.38 arc-45 33.92,22.83 arc45 32.96,23.23 30.91,23.23 arc45 30.43,23.03 arc-45 30.06,22.88 28.93,22.88 arc-90 28.57,23.23 28.57,23.73 arc90 28.23,24.08 U17.1
N$18
  Top 0.152: U19.2 43.76,22.38 arc-45 42.67,22.83 arc45 41.71,23.23 39.66,23.23 arc45 39.17,23.03 arc-45 38.81,22.88 37.67,22.88 arc-90 37.33,23.23 37.33,23.73 arc90 36.98,24.08 U18.1
N$19
  Top 0.152: U20.2 52.51,22.38 arc-45 51.42,22.83 arc45 50.46,23.23 48.41,23.23 arc45 47.92,23.03 arc-45 47.56,22.88 46.42,22.88 arc-90 46.08,23.23 46.08,23.73 arc90 45.73,24.08 U19.1
N$20  (via drill 0.2)
  Top 0.152: U20.1 53.85,24.08 55.5,22.43 arc45 v55.62,22.38 | v15.62,13.63 U21.2
  Bottom 0.152: v55.62,22.38 61.84,22.38 arc-90 64.38,19.84 64.38,18.05 arc-90 61.94,15.61 17.6,15.61 arc90 v15.62,13.63
N$21
  Top 0.152: U22.2 26.26,13.63 arc-45 25.18,14.08 arc45 24.21,14.48 22.16,14.48 arc45 21.68,14.28 arc-45 21.31,14.13 20.18,14.13 arc-90 19.82,14.48 19.82,14.98 arc90 19.48,15.33 U21.1
N$22
  Top 0.152: U23.2 35.01,13.63 arc-45 33.92,14.08 arc45 32.96,14.48 30.91,14.48 arc45 30.43,14.28 arc-45 30.06,14.13 28.93,14.13 arc-90 28.57,14.48 28.57,14.98 arc90 28.23,15.33 U22.1
N$23
  Top 0.152: U24.2 43.76,13.63 arc-45 42.67,14.08 arc45 41.71,14.48 39.66,14.48 arc45 39.17,14.28 arc-45 38.81,14.13 37.67,14.13 arc-90 37.33,14.48 37.33,14.98 arc90 36.98,15.33 U23.1
N$24
  Top 0.152: U25.2 52.51,13.63 arc-45 51.42,14.08 arc45 50.46,14.48 48.41,14.48 arc45 47.92,14.28 arc-45 47.56,14.13 46.42,14.13 arc-90 46.08,14.48 46.08,14.98 arc90 45.73,15.33 U24.1
N$25  (via drill 0.2)
  Top 0.152: U25.1 53.85,15.33 55.5,13.68 arc45 v55.62,13.63 | U26.2 18.12,4.88 arc-90 v16.25,6.76
  Bottom 0.152: v55.62,13.63 57.46,13.63 arc-90 60,11.09 60,9.3 arc-90 57.56,6.86 16.35,6.86 arc90 v16.25,6.76
N$26
  Top 0.152: U27.2 26.26,4.88 arc-45 25.18,5.33 arc45 24.21,5.73 22.16,5.73 arc45 21.68,5.53 arc-45 21.31,5.38 20.18,5.38 arc-90 19.82,5.73 19.82,6.23 arc90 19.48,6.58 U26.1
N$27
  Top 0.152: U28.2 35.01,4.88 arc-45 33.92,5.33 arc45 32.96,5.73 30.91,5.73 arc45 30.43,5.53 arc-45 30.06,5.38 28.93,5.38 arc-90 28.57,5.73 28.57,6.23 arc90 28.23,6.58 U27.1
N$28
  Top 0.152: U29.2 43.76,4.88 arc-45 42.67,5.33 arc45 41.71,5.73 39.66,5.73 arc45 39.17,5.53 arc-45 38.81,5.38 37.67,5.38 arc-90 37.33,5.73 37.33,6.23 arc90 36.98,6.58 U28.1
N$29
  Top 0.152: U30.2 52.51,4.88 arc-45 51.42,5.33 arc45 50.46,5.73 48.41,5.73 arc45 47.92,5.53 arc-45 47.56,5.38 46.42,5.38 arc-90 46.08,5.73 46.08,6.23 arc90 45.73,6.58 U29.1
N$30
  Top 0.127: U61.41 81.37,42.34 81.61,42.34 86.29,47.02 arc-45 88.75,48.04 90.85,48.04 arc45 92.65,48.78 94.17,50.3 arc-45 96.25,51.16 97.31,51.16 arc45 98.75,51.76 arc-45 99.57,52.1 142.38,52.1 arc-45 144.64,51.16 147.22,48.59 arc-45 148.15,46.33 148.15,43.6 arc90 149.06,42.69 150,42.69 151.19,43.88 J2.P$4
N$31
  Top 0.152: U32.2 108.76,48.63 arc-45 107.67,49.08 arc45 106.71,49.48 104.66,49.48 arc45 104.17,49.28 arc-45 103.81,49.13 102.67,49.13 arc-90 102.33,49.48 102.33,49.98 arc90 101.97,50.33 U31.1
N$32
  Top 0.152: U33.2 117.51,48.63 arc-45 116.42,49.08 arc45 115.46,49.48 113.41,49.48 arc45 112.92,49.28 arc-45 112.56,49.13 111.42,49.13 arc-90 111.08,49.48 111.08,49.98 arc90 110.72,50.33 U32.1
N$33
  Top 0.152: U34.2 126.26,48.63 arc-45 125.17,49.08 arc45 124.21,49.48 122.16,49.48 arc45 121.67,49.28 arc-45 121.31,49.13 120.17,49.13 arc-90 119.83,49.48 119.83,49.98 arc90 119.47,50.33 U33.1
N$34
  Top 0.152: U35.2 135.01,48.63 arc-45 133.93,49.08 arc45 132.96,49.48 130.91,49.48 arc45 130.43,49.28 arc-45 130.06,49.13 128.93,49.13 arc-90 128.57,49.48 128.57,49.98 arc90 128.22,50.33 U34.1
N$35  (via drill 0.2)
  Top 0.152: U35.1 136.35,50.33 138.05,48.63 v138.12,48.63 | v98.12,39.88 U36.2
  Bottom 0.152: v138.12,48.63 140.62,48.63 arc-90 143.12,46.13 143.12,44.26 arc-90 140.72,41.86 100.1,41.86 arc90 v98.12,39.88
N$36
  Top 0.152: U37.2 108.76,39.88 arc-45 107.67,40.33 arc45 106.71,40.73 104.66,40.73 arc45 104.17,40.53 arc-45 103.81,40.38 102.67,40.38 arc-90 102.33,40.73 102.33,41.23 arc90 101.97,41.58 U36.1
N$37
  Top 0.152: U38.2 117.51,39.88 arc-45 116.42,40.33 arc45 115.46,40.73 113.41,40.73 arc45 112.92,40.53 arc-45 112.56,40.38 111.42,40.38 arc-90 111.08,40.73 111.08,41.23 arc90 110.72,41.58 U37.1
N$38
  Top 0.152: U39.2 126.26,39.88 arc-45 125.17,40.33 arc45 124.21,40.73 122.16,40.73 arc45 121.67,40.53 arc-45 121.31,40.38 120.17,40.38 arc-90 119.83,40.73 119.83,41.23 arc90 119.47,41.58 U38.1
N$39
  Top 0.152: U40.2 135.01,39.88 arc-45 133.93,40.33 arc45 132.96,40.73 130.91,40.73 arc45 130.43,40.53 arc-45 130.06,40.38 128.93,40.38 arc-90 128.57,40.73 128.57,41.23 arc90 128.22,41.58 U39.1
N$40  (via drill 0.2)
  Top 0.152: U40.1 136.35,41.58 138,39.93 arc45 v138.12,39.88 | v98.12,31.13 U41.2
  Bottom 0.152: v138.12,39.88 144.96,39.88 arc-90 147.5,37.34 147.5,35.55 arc-90 145.06,33.11 100.1,33.11 arc90 v98.12,31.13
N$41
  Top 0.152: U42.2 108.76,31.13 arc-45 107.67,31.58 arc45 106.71,31.98 104.66,31.98 arc45 104.17,31.78 arc-45 103.81,31.63 102.67,31.63 arc-90 102.33,31.98 102.33,32.48 arc90 101.97,32.83 U41.1
N$42
  Top 0.152: U43.2 117.51,31.13 arc-45 116.42,31.58 arc45 115.46,31.98 113.41,31.98 arc45 112.92,31.78 arc-45 112.56,31.63 111.42,31.63 arc-90 111.08,31.98 111.08,32.48 arc90 110.72,32.83 U42.1
N$43
  Top 0.152: U44.2 126.26,31.13 arc-45 125.17,31.58 arc45 124.21,31.98 122.16,31.98 arc45 121.67,31.78 arc-45 121.31,31.63 120.17,31.63 arc-90 119.83,31.98 119.83,32.48 arc90 119.47,32.83 U43.1
N$44
  Top 0.152: U45.2 135.01,31.13 arc-45 133.93,31.58 arc45 132.96,31.98 130.91,31.98 arc45 130.43,31.78 arc-45 130.06,31.63 128.93,31.63 arc-90 128.57,31.98 128.57,32.48 arc90 128.22,32.83 U44.1
N$45  (via drill 0.2)
  Top 0.152: U45.1 136.35,32.83 138,31.18 arc45 v138.12,31.13 | v98.12,22.38 U46.2
  Bottom 0.152: v138.12,31.13 144.34,31.13 arc-90 146.88,28.59 146.88,26.8 arc-90 144.44,24.36 100.1,24.36 arc90 v98.12,22.38
N$46
  Top 0.152: U47.2 108.76,22.38 arc-45 107.67,22.83 arc45 106.71,23.23 104.66,23.23 arc45 104.17,23.03 arc-45 103.81,22.88 102.67,22.88 arc-90 102.33,23.23 102.33,23.73 arc90 101.97,24.08 U46.1
N$47
  Top 0.152: U48.2 117.51,22.38 arc-45 116.42,22.83 arc45 115.46,23.23 113.41,23.23 arc45 112.92,23.03 arc-45 112.56,22.88 111.42,22.88 arc-90 111.08,23.23 111.08,23.73 arc90 110.72,24.08 U47.1
N$48
  Top 0.152: U49.2 126.26,22.38 arc-45 125.17,22.83 arc45 124.21,23.23 122.16,23.23 arc45 121.67,23.03 arc-45 121.31,22.88 120.17,22.88 arc-90 119.83,23.23 119.83,23.73 arc90 119.47,24.08 U48.1
N$49
  Top 0.152: U50.2 135.01,22.38 arc-45 133.93,22.83 arc45 132.96,23.23 130.91,23.23 arc45 130.43,23.03 arc-45 130.06,22.88 128.93,22.88 arc-90 128.57,23.23 128.57,23.73 arc90 128.22,24.08 U49.1
N$50  (via drill 0.2)
  Top 0.152: U50.1 136.35,24.08 138,22.43 arc45 v138.12,22.38 | v98.12,13.63 U51.2
  Bottom 0.152: v138.12,22.38 143.09,22.38 arc-90 145.62,19.84 145.62,18.05 arc-90 143.19,15.61 100.1,15.61 arc90 v98.12,13.63
N$51
  Top 0.152: U52.2 108.76,13.63 arc-45 107.67,14.08 arc45 106.71,14.48 104.66,14.48 arc45 104.17,14.28 arc-45 103.81,14.13 102.67,14.13 arc-90 102.33,14.48 102.33,14.98 arc90 101.97,15.33 U51.1
N$52
  Top 0.152: U53.2 117.51,13.63 arc-45 116.42,14.08 arc45 115.46,14.48 113.41,14.48 arc45 112.92,14.28 arc-45 112.56,14.13 111.42,14.13 arc-90 111.08,14.48 111.08,14.98 arc90 110.72,15.33 U52.1
N$53
  Top 0.152: U54.2 126.26,13.63 arc-45 125.17,14.08 arc45 124.21,14.48 122.16,14.48 arc45 121.67,14.28 arc-45 121.31,14.13 120.17,14.13 arc-90 119.83,14.48 119.83,14.98 arc90 119.47,15.33 U53.1
N$54
  Top 0.152: U55.2 135.01,13.63 arc-45 133.93,14.08 arc45 132.96,14.48 130.91,14.48 arc45 130.43,14.28 arc-45 130.06,14.13 128.93,14.13 arc-90 128.57,14.48 128.57,14.98 arc90 128.22,15.33 U54.1
N$55  (via drill 0.2)
  Top 0.152: U55.1 136.35,15.33 138,13.68 arc45 v138.12,13.63 | v98.12,4.88 U56.2
  Bottom 0.152: v138.12,13.63 140.59,13.63 arc-90 143.12,11.09 143.12,9.3 arc-90 140.69,6.86 100.1,6.86 arc90 v98.12,4.88
N$56
  Top 0.152: U57.2 108.76,4.88 arc-45 107.67,5.33 arc45 106.71,5.73 104.66,5.73 arc45 104.17,5.53 arc-45 103.81,5.38 102.67,5.38 arc-90 102.33,5.73 102.33,6.23 arc90 101.97,6.58 U56.1
N$57
  Top 0.152: U58.2 117.51,4.88 arc-45 116.42,5.33 arc45 115.46,5.73 113.41,5.73 arc45 112.92,5.53 arc-45 112.56,5.38 111.42,5.38 arc-90 111.08,5.73 111.08,6.23 arc90 110.72,6.58 U57.1
N$58
  Top 0.152: U59.2 126.26,4.88 arc-45 125.17,5.33 arc45 124.21,5.73 122.16,5.73 arc45 121.67,5.53 arc-45 121.31,5.38 120.17,5.38 arc-90 119.83,5.73 119.83,6.23 arc90 119.47,6.58 U58.1
N$59
  Top 0.152: U60.2 135.01,4.88 arc-45 133.93,5.33 arc45 132.96,5.73 130.91,5.73 arc45 130.43,5.53 arc-45 130.06,5.38 128.93,5.38 arc-90 128.57,5.73 128.57,6.23 arc90 128.22,6.58 U59.1
N$60  (via drill 0.2)
  Top 0.152: U30.1 53.3,6.58 arc-90 55,4.88 v55,3.66 | U31.2 v98.65,48.63
  Bottom 0.152: v98.65,48.63 95.67,48.63 arc90 92.5,45.47 92.5,43.25 arc-96 80.11,32.23 arc44 74.72,30.69 arc38 69.38,22.38 arc-6 67.5,16.13 arc-8 65,10.51 arc-2 61.88,4.88 arc-63 56.87,1.79 arc-90 v55,3.66
N$61
  Top 0.152: U1.2 18.03,48.63 R1.2
N$62
  Top 0.127: C13.1 75.22,42.33
  Top 0.152: C13.1 arc-45 76.33,41.97 U61.6
N$63
  Top 0.127: U61.40 86.52,46.79 arc-45 88.75,47.71 90.85,47.71 arc45 92.88,48.55 94.4,50.07 arc-45 96.25,50.83 97.31,50.83 arc45 98.98,51.53 arc-45 99.57,51.77 142.38,51.77 arc-45 144.41,50.93 146.99,48.36 arc-45 147.83,46.33 147.83,43.6 arc90 149.06,42.37 152.96,42.37 J2.P$3
N$64
  Top 0.127: U61.39 82.08,41.64 82.08,41.88 86.75,46.55 arc-45 88.75,47.38 90.85,47.38 arc45 93.11,48.32 94.63,49.83 arc-45 96.25,50.51 97.31,50.51 arc45 99.21,51.29 arc-45 99.57,51.44 142.38,51.44 arc-45 144.18,50.7 146.76,48.13 arc-45 147.5,46.33 147.5,43.6 arc90 149.06,42.04 150.03,42.04 151.19,40.88 J2.P$2
N$67
  Top 0.203: U61.16 75.62,35.88 73.33,35.88 X1.P$2 | 73.17,34.92 C16.1
  Top 0.305: X1.P$2 73.17,34.92
N$68
  Top 0.203: U61.17 75.97,35.53 75.97,33.29 | X1.P$1 75.39,33.1 73.71,31.42 C15.1
  Top 0.305: 75.97,33.29 X1.P$1
N$77
  Top 0.152: R4.2 85.43,36.41 U61.33
RST  (via drill 0.2)
  Top 0.152: v85.47,39.13 87.65,39.13 arc45 S1.2 | 75.37,37.75 U61.13 v74.89,37.27
  Bottom 0.152: v74.89,37.27 77.04,37.27 79.03,35.27 arc45 79.38,35.13 arc45 79.72,35.27 83.06,38.62 arc-45 84.3,39.13 v85.47,39.13
USB1_N
  Top 0.127: R2.1 7.73,48.32 6.96,47.54 6.88,47.54 arc90 5.92,46.59 5.92,46.13 arc90 6.88,45.18 7.2,45.18 arc-90 7.81,44.57 7.81,43.63 arc-90 7.05,42.87 5.77,42.87 5.6,43.03 J1.D-
USB1_P
  Top 0.127: R3.1 7.73,46.44 6.96,47.22 6.88,47.22 arc90 6.25,46.59 6.25,46.13 arc90 6.88,45.51 7.2,45.51 arc-90 8.14,44.57 8.14,43.63 arc-90 7.05,42.54 5.77,42.54 5.6,42.38 J1.D+
USB_N
  Top 0.127: U61.3 77.87,42.56 77.75,42.56 76.94,43.37 arc45 72.25,45.31 68.5,45.31 arc-45 64.49,46.97 61.38,50.07 arc45 57.8,51.56 16.34,51.56 arc90 13.44,48.66 13.44,48.48 arc-90 12.5,47.54 12.41,47.54 11.64,48.32 R2.2
USB_P
  Top 0.127: U61.4 77.68,42.17 76.7,43.14 arc45 72.25,44.98 68.5,44.98 arc-45 64.25,46.74 61.24,49.75 arc45 57.67,51.23 16.34,51.23 arc90 13.76,48.66 13.76,48.48 arc-90 12.5,47.22 12.41,47.22 11.64,46.44 R3.2

### Text on the board
tNames: DFU / Bootloader
bNames: github.com/joshuaboud/pixel_eyes